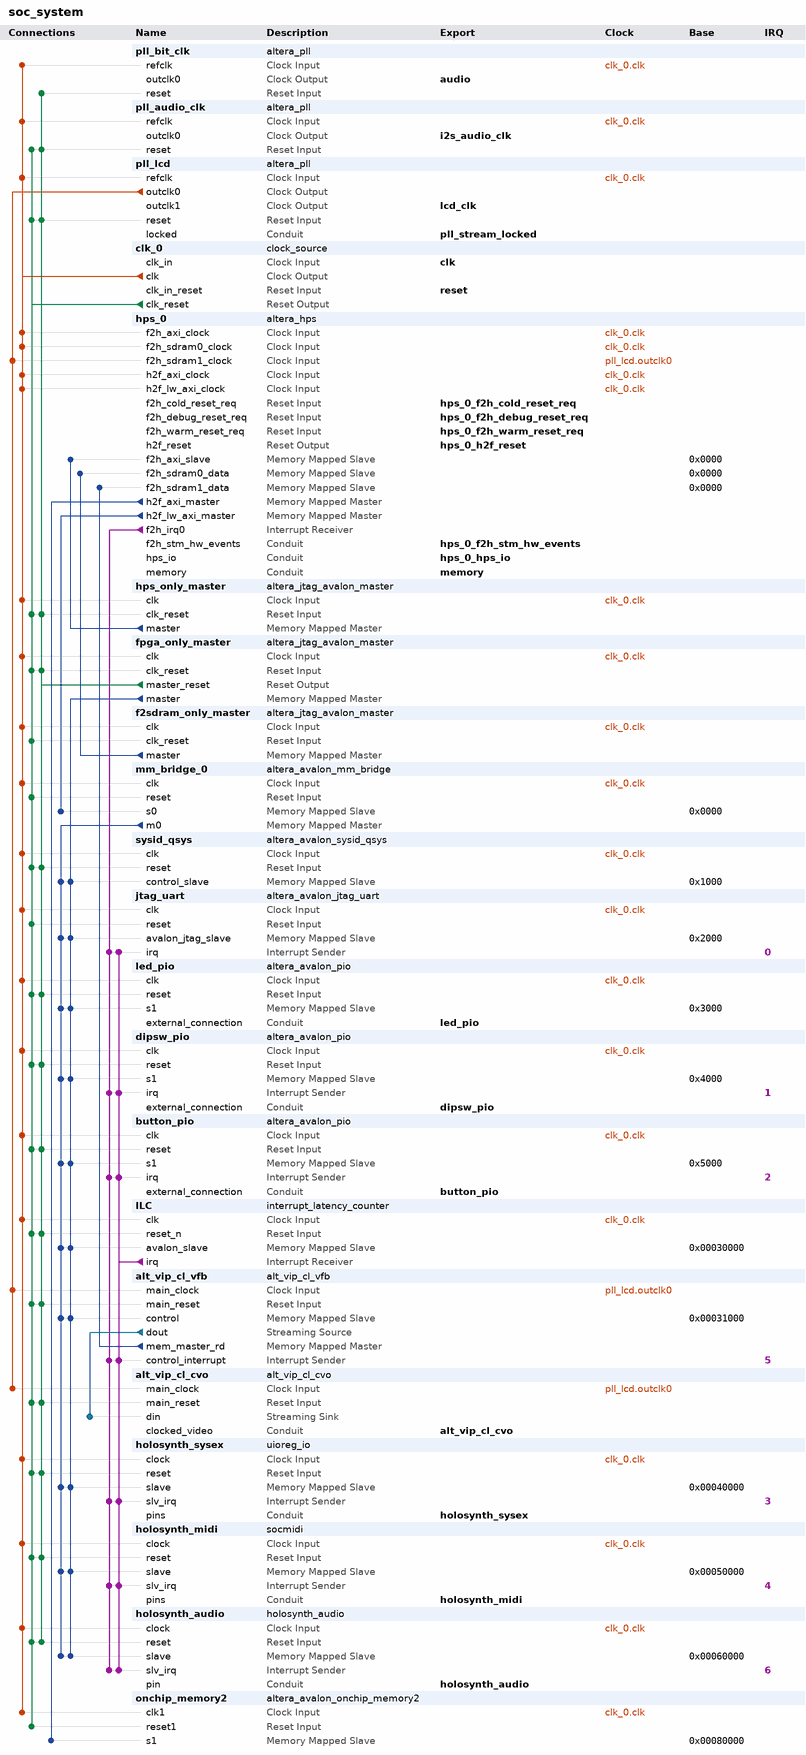
[diagram p0: system contents]
# Platform Designer (Qsys) system soc_system, Cyclone V 5CSEBA6U23I7
# Parameters at their usual value, and those the tool derives, are not listed.
package require -exact qsys 17.1
create_system soc_system
set_project_property DEVICE_FAMILY {Cyclone V}
set_project_property DEVICE 5CSEBA6U23I7

add_instance pll_bit_clk altera_pll 17.1
set_instance_parameter_value pll_bit_clk gui_device_speed_grade 2
set_instance_parameter_value pll_bit_clk gui_number_of_clocks 1
set_instance_parameter_value pll_bit_clk gui_operation_mode direct
set_instance_parameter_value pll_bit_clk gui_output_clock_frequency0 100.0
set_instance_parameter_value pll_bit_clk gui_pll_mode {Integer-N PLL}
set_instance_parameter_value pll_bit_clk gui_reference_clock_frequency 50.0
set_instance_parameter_value pll_bit_clk gui_use_locked false

add_instance pll_audio_clk altera_pll 17.1
set_instance_parameter_value pll_audio_clk gui_device_speed_grade 2
set_instance_parameter_value pll_audio_clk gui_number_of_clocks 1
set_instance_parameter_value pll_audio_clk gui_operation_mode direct
set_instance_parameter_value pll_audio_clk gui_output_clock_frequency0 33.8688
set_instance_parameter_value pll_audio_clk gui_pll_mode {Fractional-N PLL}
set_instance_parameter_value pll_audio_clk gui_reference_clock_frequency 50.0
set_instance_parameter_value pll_audio_clk gui_use_locked false

add_instance pll_lcd altera_pll 17.1
set_instance_parameter_value pll_lcd gui_device_speed_grade 2
set_instance_parameter_value pll_lcd gui_number_of_clocks 2
set_instance_parameter_value pll_lcd gui_operation_mode normal
set_instance_parameter_value pll_lcd gui_output_clock_frequency0 148.5
set_instance_parameter_value pll_lcd gui_output_clock_frequency1 148.5
set_instance_parameter_value pll_lcd gui_pll_mode {Fractional-N PLL}
set_instance_parameter_value pll_lcd gui_reference_clock_frequency 50.0
set_instance_parameter_value pll_lcd gui_use_locked true

add_instance clk_0 clock_source 17.1
set_instance_parameter_value clk_0 clockFrequency 50000000

add_instance hps_0 altera_hps 17.1
set_instance_parameter_value hps_0 EMAC1_Mode RGMII
set_instance_parameter_value hps_0 EMAC1_PinMuxing {HPS I/O Set 0}
set_instance_parameter_value hps_0 F2SCLK_COLDRST_Enable true
set_instance_parameter_value hps_0 F2SCLK_DBGRST_Enable true
set_instance_parameter_value hps_0 F2SCLK_WARMRST_Enable true
set_instance_parameter_value hps_0 F2SDRAM_Type {Avalon-MM Bidirectional,Avalon-MM Read-Only}
set_instance_parameter_value hps_0 F2SDRAM_Width 128,128
set_instance_parameter_value hps_0 F2SINTERRUPT_Enable true
set_instance_parameter_value hps_0 F2S_Width 2
set_instance_parameter_value hps_0 FPGA_PERIPHERAL_OUTPUT_CLOCK_FREQ_EMAC0_GTX_CLK 100
set_instance_parameter_value hps_0 FPGA_PERIPHERAL_OUTPUT_CLOCK_FREQ_EMAC0_MD_CLK 100.0
set_instance_parameter_value hps_0 FPGA_PERIPHERAL_OUTPUT_CLOCK_FREQ_EMAC1_GTX_CLK 100
set_instance_parameter_value hps_0 FPGA_PERIPHERAL_OUTPUT_CLOCK_FREQ_EMAC1_MD_CLK 100.0
set_instance_parameter_value hps_0 HPS_PROTOCOL DDR3
set_instance_parameter_value hps_0 I2C0_Mode I2C
set_instance_parameter_value hps_0 I2C0_PinMuxing {HPS I/O Set 0}
set_instance_parameter_value hps_0 I2C1_Mode I2C
set_instance_parameter_value hps_0 I2C1_PinMuxing {HPS I/O Set 0}
set_instance_parameter_value hps_0 LWH2F_Enable true
set_instance_parameter_value hps_0 MEM_BANKADDR_WIDTH 3
set_instance_parameter_value hps_0 MEM_CLK_FREQ 400.0
set_instance_parameter_value hps_0 MEM_COL_ADDR_WIDTH 10
set_instance_parameter_value hps_0 MEM_DQ_WIDTH 32
set_instance_parameter_value hps_0 MEM_DRV_STR RZQ/6
set_instance_parameter_value hps_0 MEM_ROW_ADDR_WIDTH 15
set_instance_parameter_value hps_0 MEM_RTT_NOM RZQ/6
set_instance_parameter_value hps_0 MEM_RTT_WR {Dynamic ODT off}
set_instance_parameter_value hps_0 MEM_TCL 7
set_instance_parameter_value hps_0 MEM_TFAW_NS 37.5
set_instance_parameter_value hps_0 MEM_TRAS_NS 35.0
set_instance_parameter_value hps_0 MEM_TRCD_NS 13.75
set_instance_parameter_value hps_0 MEM_TRFC_NS 300.0
set_instance_parameter_value hps_0 MEM_TRP_NS 13.75
set_instance_parameter_value hps_0 MEM_VENDOR Other
set_instance_parameter_value hps_0 MEM_WTCL 7
set_instance_parameter_value hps_0 QSPI_Mode N/A
set_instance_parameter_value hps_0 QSPI_PinMuxing Unused
set_instance_parameter_value hps_0 REF_CLK_FREQ 25.0
set_instance_parameter_value hps_0 S2FCLK_USER0CLK_Enable true
set_instance_parameter_value hps_0 S2FCLK_USER2CLK 4
set_instance_parameter_value hps_0 S2F_Width 2
set_instance_parameter_value hps_0 SDIO_Mode {4-bit Data}
set_instance_parameter_value hps_0 SDIO_PinMuxing {HPS I/O Set 0}
set_instance_parameter_value hps_0 SPIM1_Mode {Single Slave Select}
set_instance_parameter_value hps_0 SPIM1_PinMuxing {HPS I/O Set 0}
set_instance_parameter_value hps_0 STM_Enable true
set_instance_parameter_value hps_0 TIMING_BOARD_AC_SKEW 0.02
set_instance_parameter_value hps_0 TIMING_BOARD_AC_TO_CK_SKEW 0.0
set_instance_parameter_value hps_0 TIMING_BOARD_DQ_TO_DQS_SKEW 0.0
set_instance_parameter_value hps_0 TIMING_BOARD_MAX_CK_DELAY 0.6
set_instance_parameter_value hps_0 TIMING_BOARD_MAX_DQS_DELAY 0.6
set_instance_parameter_value hps_0 TIMING_BOARD_SKEW_BETWEEN_DQS 0.02
set_instance_parameter_value hps_0 TIMING_BOARD_SKEW_CKDQS_DIMM_MAX 0.01
set_instance_parameter_value hps_0 TIMING_BOARD_SKEW_CKDQS_DIMM_MIN -0.01
set_instance_parameter_value hps_0 TIMING_BOARD_SKEW_WITHIN_DQS 0.02
set_instance_parameter_value hps_0 TIMING_TDH 125
set_instance_parameter_value hps_0 TIMING_TDQSCK 400
set_instance_parameter_value hps_0 TIMING_TDQSQ 120
set_instance_parameter_value hps_0 TIMING_TDS 50
set_instance_parameter_value hps_0 TIMING_TIH 250
set_instance_parameter_value hps_0 TIMING_TIS 175
set_instance_parameter_value hps_0 TIMING_TQSH 0.38
set_instance_parameter_value hps_0 UART0_Mode {No Flow Control}
set_instance_parameter_value hps_0 UART0_PinMuxing {HPS I/O Set 0}
set_instance_parameter_value hps_0 USB1_Mode SDR
set_instance_parameter_value hps_0 USB1_PinMuxing {HPS I/O Set 0}
set_instance_parameter_value hps_0 desired_cfg_clk_mhz 100.0
set_instance_parameter_value hps_0 desired_qspi_clk_mhz 370.0

add_instance hps_only_master altera_jtag_avalon_master 17.1

add_instance fpga_only_master altera_jtag_avalon_master 17.1

add_instance f2sdram_only_master altera_jtag_avalon_master 17.1

add_instance mm_bridge_0 altera_avalon_mm_bridge 17.1
set_instance_parameter_value mm_bridge_0 ADDRESS_UNITS SYMBOLS
set_instance_parameter_value mm_bridge_0 ADDRESS_WIDTH 10
set_instance_parameter_value mm_bridge_0 DATA_WIDTH 32
set_instance_parameter_value mm_bridge_0 MAX_PENDING_RESPONSES 4
set_instance_parameter_value mm_bridge_0 USE_AUTO_ADDRESS_WIDTH 1

add_instance sysid_qsys altera_avalon_sysid_qsys 17.1
set_instance_parameter_value sysid_qsys id -1395322108

add_instance jtag_uart altera_avalon_jtag_uart 17.1
set_instance_parameter_value jtag_uart allowMultipleConnections true
set_instance_parameter_value jtag_uart simInteractiveOptions INTERACTIVE_ASCII_OUTPUT

add_instance led_pio altera_avalon_pio 17.1
set_instance_parameter_value led_pio direction Output
set_instance_parameter_value led_pio resetValue 255
set_instance_parameter_value led_pio width 8

add_instance dipsw_pio altera_avalon_pio 17.1
set_instance_parameter_value dipsw_pio bitClearingEdgeCapReg true
set_instance_parameter_value dipsw_pio captureEdge true
set_instance_parameter_value dipsw_pio direction Input
set_instance_parameter_value dipsw_pio edgeType ANY
set_instance_parameter_value dipsw_pio generateIRQ true
set_instance_parameter_value dipsw_pio irqType EDGE
set_instance_parameter_value dipsw_pio width 4

add_instance button_pio altera_avalon_pio 17.1
set_instance_parameter_value button_pio bitClearingEdgeCapReg true
set_instance_parameter_value button_pio captureEdge true
set_instance_parameter_value button_pio direction Input
set_instance_parameter_value button_pio edgeType FALLING
set_instance_parameter_value button_pio generateIRQ true
set_instance_parameter_value button_pio irqType EDGE
set_instance_parameter_value button_pio width 2

add_instance ILC interrupt_latency_counter 17.1
set_instance_parameter_value ILC IRQ_PORT_CNT 7

add_instance alt_vip_cl_vfb alt_vip_cl_vfb 17.1
set_instance_parameter_value alt_vip_cl_vfb CLOCKS_ARE_SEPARATE 0
set_instance_parameter_value alt_vip_cl_vfb DROP_FRAMES 1
set_instance_parameter_value alt_vip_cl_vfb DROP_INVALID_FIELDS 1
set_instance_parameter_value alt_vip_cl_vfb DROP_REPEAT_USER 0
set_instance_parameter_value alt_vip_cl_vfb IS_FRAME_READER 1
set_instance_parameter_value alt_vip_cl_vfb LINE_BASED_BUFFERING 0
set_instance_parameter_value alt_vip_cl_vfb MAX_HEIGHT 1080
set_instance_parameter_value alt_vip_cl_vfb MAX_WIDTH 1920
set_instance_parameter_value alt_vip_cl_vfb MEM_BASE_ADDR 536870912
set_instance_parameter_value alt_vip_cl_vfb MEM_BUFFER_OFFSET 16777216
set_instance_parameter_value alt_vip_cl_vfb MEM_PORT_WIDTH 128
set_instance_parameter_value alt_vip_cl_vfb NUMBER_OF_COLOR_PLANES 4
set_instance_parameter_value alt_vip_cl_vfb READER_RUNTIME_CONTROL 1
set_instance_parameter_value alt_vip_cl_vfb READ_BURST_TARGET 64
set_instance_parameter_value alt_vip_cl_vfb READ_FIFO_DEPTH 512
set_instance_parameter_value alt_vip_cl_vfb USER_PACKETS_MAX_STORAGE 0
set_instance_parameter_value alt_vip_cl_vfb USE_BUFFER_OFFSET 0
set_instance_parameter_value alt_vip_cl_vfb WRITE_BURST_TARGET 64
set_instance_parameter_value alt_vip_cl_vfb WRITE_FIFO_DEPTH 512

add_instance alt_vip_cl_cvo alt_vip_cl_cvo 17.1
set_instance_parameter_value alt_vip_cl_cvo ACCEPT_COLOURS_IN_SEQ 0
set_instance_parameter_value alt_vip_cl_cvo ACCEPT_SYNC 0
set_instance_parameter_value alt_vip_cl_cvo ANC_LINE 0
set_instance_parameter_value alt_vip_cl_cvo AP_LINE 0
set_instance_parameter_value alt_vip_cl_cvo BPS 8
set_instance_parameter_value alt_vip_cl_cvo CLOCKS_ARE_SAME 1
set_instance_parameter_value alt_vip_cl_cvo COLOUR_PLANES_ARE_IN_PARALLEL 1
set_instance_parameter_value alt_vip_cl_cvo CONTEXT_WIDTH 8
set_instance_parameter_value alt_vip_cl_cvo COUNT_STEP_IS_PIP_VALUE 0
set_instance_parameter_value alt_vip_cl_cvo DST_WIDTH 8
set_instance_parameter_value alt_vip_cl_cvo FIELD0_ANC_LINE 0
set_instance_parameter_value alt_vip_cl_cvo FIELD0_V_BACK_PORCH 0
set_instance_parameter_value alt_vip_cl_cvo FIELD0_V_BLANK 0
set_instance_parameter_value alt_vip_cl_cvo FIELD0_V_FRONT_PORCH 0
set_instance_parameter_value alt_vip_cl_cvo FIELD0_V_RISING_EDGE 0
set_instance_parameter_value alt_vip_cl_cvo FIELD0_V_SYNC_LENGTH 0
set_instance_parameter_value alt_vip_cl_cvo FIFO_DEPTH 1920
set_instance_parameter_value alt_vip_cl_cvo F_FALLING_EDGE 0
set_instance_parameter_value alt_vip_cl_cvo F_RISING_EDGE 0
set_instance_parameter_value alt_vip_cl_cvo GENERATE_SYNC 0
set_instance_parameter_value alt_vip_cl_cvo H_ACTIVE_PIXELS 1920
set_instance_parameter_value alt_vip_cl_cvo H_BACK_PORCH 148
set_instance_parameter_value alt_vip_cl_cvo H_BLANK 0
set_instance_parameter_value alt_vip_cl_cvo H_FRONT_PORCH 88
set_instance_parameter_value alt_vip_cl_cvo H_SYNC_LENGTH 44
set_instance_parameter_value alt_vip_cl_cvo INTERLACED 0
set_instance_parameter_value alt_vip_cl_cvo LOW_LATENCY 0
set_instance_parameter_value alt_vip_cl_cvo NO_OF_CHANNELS 1
set_instance_parameter_value alt_vip_cl_cvo NO_OF_MODES 1
set_instance_parameter_value alt_vip_cl_cvo NUMBER_OF_COLOUR_PLANES 4
set_instance_parameter_value alt_vip_cl_cvo PIXELS_IN_PARALLEL 1
set_instance_parameter_value alt_vip_cl_cvo SRC_WIDTH 8
set_instance_parameter_value alt_vip_cl_cvo STD_WIDTH 1
set_instance_parameter_value alt_vip_cl_cvo TASK_WIDTH 8
set_instance_parameter_value alt_vip_cl_cvo THRESHOLD 1919
set_instance_parameter_value alt_vip_cl_cvo USE_CONTROL 0
set_instance_parameter_value alt_vip_cl_cvo USE_EMBEDDED_SYNCS 0
set_instance_parameter_value alt_vip_cl_cvo V_ACTIVE_LINES 1080
set_instance_parameter_value alt_vip_cl_cvo V_BACK_PORCH 36
set_instance_parameter_value alt_vip_cl_cvo V_BLANK 0
set_instance_parameter_value alt_vip_cl_cvo V_FRONT_PORCH 4
set_instance_parameter_value alt_vip_cl_cvo V_SYNC_LENGTH 5

add_instance holosynth_sysex uioreg_io 1.1
set_instance_parameter_value holosynth_sysex ADDRESS_WIDTH 10
set_instance_parameter_value holosynth_sysex DATA_WIDTH 32
set_instance_parameter_value holosynth_sysex IRQ_EN 0

add_instance holosynth_midi socmidi 1.0
set_instance_parameter_value holosynth_midi ADDRESS_WIDTH 3
set_instance_parameter_value holosynth_midi DATA_WIDTH 8
set_instance_parameter_value holosynth_midi IRQ_EN 0

add_instance holosynth_audio holosynth_audio 1.0
set_instance_parameter_value holosynth_audio ADDRESS_WIDTH 14
set_instance_parameter_value holosynth_audio AUD_BIT_DEPTH 24
set_instance_parameter_value holosynth_audio DATA_WIDTH 32
set_instance_parameter_value holosynth_audio FIFO_WIDTH 10
set_instance_parameter_value holosynth_audio IRQ_EN 0

add_instance onchip_memory2 altera_avalon_onchip_memory2 17.1
set_instance_parameter_value onchip_memory2 dataWidth 64
set_instance_parameter_value onchip_memory2 dualPort false
set_instance_parameter_value onchip_memory2 initMemContent true
set_instance_parameter_value onchip_memory2 initializationFileName onchip_mem.hex
set_instance_parameter_value onchip_memory2 memorySize 262144

# connections
add_connection clk_0.clk button_pio.clk clock
add_connection clk_0.clk dipsw_pio.clk clock
add_connection clk_0.clk f2sdram_only_master.clk clock
add_connection clk_0.clk fpga_only_master.clk clock
add_connection clk_0.clk holosynth_audio.clock clock
add_connection clk_0.clk holosynth_midi.clock clock
add_connection clk_0.clk holosynth_sysex.clock clock
add_connection clk_0.clk hps_0.f2h_axi_clock clock
add_connection clk_0.clk hps_0.f2h_sdram0_clock clock
add_connection clk_0.clk hps_0.h2f_axi_clock clock
add_connection clk_0.clk hps_0.h2f_lw_axi_clock clock
add_connection clk_0.clk hps_only_master.clk clock
add_connection clk_0.clk ILC.clk clock
add_connection clk_0.clk jtag_uart.clk clock
add_connection clk_0.clk led_pio.clk clock
add_connection clk_0.clk mm_bridge_0.clk clock
add_connection clk_0.clk onchip_memory2.clk1 clock
add_connection clk_0.clk pll_audio_clk.refclk clock
add_connection clk_0.clk pll_bit_clk.refclk clock
add_connection clk_0.clk pll_lcd.refclk clock
add_connection clk_0.clk sysid_qsys.clk clock
add_connection pll_lcd.outclk0 alt_vip_cl_cvo.main_clock clock
add_connection pll_lcd.outclk0 alt_vip_cl_vfb.main_clock clock
add_connection pll_lcd.outclk0 hps_0.f2h_sdram1_clock clock
add_connection clk_0.clk_reset alt_vip_cl_cvo.main_reset reset
add_connection clk_0.clk_reset alt_vip_cl_vfb.main_reset reset
add_connection clk_0.clk_reset button_pio.reset reset
add_connection clk_0.clk_reset dipsw_pio.reset reset
add_connection clk_0.clk_reset f2sdram_only_master.clk_reset reset
add_connection clk_0.clk_reset fpga_only_master.clk_reset reset
add_connection clk_0.clk_reset holosynth_audio.reset reset
add_connection clk_0.clk_reset holosynth_midi.reset reset
add_connection clk_0.clk_reset holosynth_sysex.reset reset
add_connection clk_0.clk_reset hps_only_master.clk_reset reset
add_connection clk_0.clk_reset ILC.reset_n reset
add_connection clk_0.clk_reset jtag_uart.reset reset
add_connection clk_0.clk_reset led_pio.reset reset
add_connection clk_0.clk_reset mm_bridge_0.reset reset
add_connection clk_0.clk_reset onchip_memory2.reset1 reset
add_connection clk_0.clk_reset pll_audio_clk.reset reset
add_connection clk_0.clk_reset pll_lcd.reset reset
add_connection clk_0.clk_reset sysid_qsys.reset reset
add_connection fpga_only_master.master_reset alt_vip_cl_cvo.main_reset reset
add_connection fpga_only_master.master_reset alt_vip_cl_vfb.main_reset reset
add_connection fpga_only_master.master_reset button_pio.reset reset
add_connection fpga_only_master.master_reset dipsw_pio.reset reset
add_connection fpga_only_master.master_reset fpga_only_master.clk_reset reset
add_connection fpga_only_master.master_reset holosynth_audio.reset reset
add_connection fpga_only_master.master_reset holosynth_midi.reset reset
add_connection fpga_only_master.master_reset holosynth_sysex.reset reset
add_connection fpga_only_master.master_reset hps_only_master.clk_reset reset
add_connection fpga_only_master.master_reset ILC.reset_n reset
add_connection fpga_only_master.master_reset led_pio.reset reset
add_connection fpga_only_master.master_reset pll_audio_clk.reset reset
add_connection fpga_only_master.master_reset pll_bit_clk.reset reset
add_connection fpga_only_master.master_reset pll_lcd.reset reset
add_connection fpga_only_master.master_reset sysid_qsys.reset reset
add_connection alt_vip_cl_vfb.mem_master_rd hps_0.f2h_sdram1_data avalon
set_connection_parameter_value alt_vip_cl_vfb.mem_master_rd/hps_0.f2h_sdram1_data baseAddress 0x0000
add_connection f2sdram_only_master.master hps_0.f2h_sdram0_data avalon
set_connection_parameter_value f2sdram_only_master.master/hps_0.f2h_sdram0_data baseAddress 0x0000
add_connection fpga_only_master.master alt_vip_cl_vfb.control avalon
set_connection_parameter_value fpga_only_master.master/alt_vip_cl_vfb.control baseAddress 0x00031000
add_connection fpga_only_master.master button_pio.s1 avalon
set_connection_parameter_value fpga_only_master.master/button_pio.s1 baseAddress 0x5000
add_connection fpga_only_master.master dipsw_pio.s1 avalon
set_connection_parameter_value fpga_only_master.master/dipsw_pio.s1 baseAddress 0x4000
add_connection fpga_only_master.master holosynth_audio.slave avalon
set_connection_parameter_value fpga_only_master.master/holosynth_audio.slave baseAddress 0x00060000
add_connection fpga_only_master.master holosynth_midi.slave avalon
set_connection_parameter_value fpga_only_master.master/holosynth_midi.slave baseAddress 0x00050000
add_connection fpga_only_master.master holosynth_sysex.slave avalon
set_connection_parameter_value fpga_only_master.master/holosynth_sysex.slave baseAddress 0x00040000
add_connection fpga_only_master.master ILC.avalon_slave avalon
set_connection_parameter_value fpga_only_master.master/ILC.avalon_slave baseAddress 0x00030000
add_connection fpga_only_master.master jtag_uart.avalon_jtag_slave avalon
set_connection_parameter_value fpga_only_master.master/jtag_uart.avalon_jtag_slave baseAddress 0x2000
add_connection fpga_only_master.master led_pio.s1 avalon
set_connection_parameter_value fpga_only_master.master/led_pio.s1 baseAddress 0x3000
add_connection fpga_only_master.master sysid_qsys.control_slave avalon
set_connection_parameter_value fpga_only_master.master/sysid_qsys.control_slave baseAddress 0x1000
add_connection hps_0.h2f_axi_master onchip_memory2.s1 avalon
set_connection_parameter_value hps_0.h2f_axi_master/onchip_memory2.s1 baseAddress 0x00080000
add_connection hps_0.h2f_lw_axi_master mm_bridge_0.s0 avalon
set_connection_parameter_value hps_0.h2f_lw_axi_master/mm_bridge_0.s0 baseAddress 0x0000
add_connection hps_only_master.master hps_0.f2h_axi_slave avalon
set_connection_parameter_value hps_only_master.master/hps_0.f2h_axi_slave baseAddress 0x0000
add_connection mm_bridge_0.m0 alt_vip_cl_vfb.control avalon
set_connection_parameter_value mm_bridge_0.m0/alt_vip_cl_vfb.control baseAddress 0x00031000
add_connection mm_bridge_0.m0 button_pio.s1 avalon
set_connection_parameter_value mm_bridge_0.m0/button_pio.s1 baseAddress 0x5000
add_connection mm_bridge_0.m0 dipsw_pio.s1 avalon
set_connection_parameter_value mm_bridge_0.m0/dipsw_pio.s1 baseAddress 0x4000
add_connection mm_bridge_0.m0 holosynth_audio.slave avalon
set_connection_parameter_value mm_bridge_0.m0/holosynth_audio.slave baseAddress 0x00060000
add_connection mm_bridge_0.m0 holosynth_midi.slave avalon
set_connection_parameter_value mm_bridge_0.m0/holosynth_midi.slave baseAddress 0x00050000
add_connection mm_bridge_0.m0 holosynth_sysex.slave avalon
set_connection_parameter_value mm_bridge_0.m0/holosynth_sysex.slave baseAddress 0x00040000
add_connection mm_bridge_0.m0 ILC.avalon_slave avalon
set_connection_parameter_value mm_bridge_0.m0/ILC.avalon_slave baseAddress 0x00030000
add_connection mm_bridge_0.m0 jtag_uart.avalon_jtag_slave avalon
set_connection_parameter_value mm_bridge_0.m0/jtag_uart.avalon_jtag_slave baseAddress 0x2000
add_connection mm_bridge_0.m0 led_pio.s1 avalon
set_connection_parameter_value mm_bridge_0.m0/led_pio.s1 baseAddress 0x3000
add_connection mm_bridge_0.m0 sysid_qsys.control_slave avalon
set_connection_parameter_value mm_bridge_0.m0/sysid_qsys.control_slave baseAddress 0x1000
add_connection alt_vip_cl_vfb.dout alt_vip_cl_cvo.din avalon_streaming
add_connection hps_0.f2h_irq0 alt_vip_cl_vfb.control_interrupt interrupt
set_connection_parameter_value hps_0.f2h_irq0/alt_vip_cl_vfb.control_interrupt irqNumber 5
add_connection hps_0.f2h_irq0 button_pio.irq interrupt
set_connection_parameter_value hps_0.f2h_irq0/button_pio.irq irqNumber 2
add_connection hps_0.f2h_irq0 dipsw_pio.irq interrupt
set_connection_parameter_value hps_0.f2h_irq0/dipsw_pio.irq irqNumber 1
add_connection hps_0.f2h_irq0 holosynth_audio.slv_irq interrupt
set_connection_parameter_value hps_0.f2h_irq0/holosynth_audio.slv_irq irqNumber 6
add_connection hps_0.f2h_irq0 holosynth_midi.slv_irq interrupt
set_connection_parameter_value hps_0.f2h_irq0/holosynth_midi.slv_irq irqNumber 4
add_connection hps_0.f2h_irq0 holosynth_sysex.slv_irq interrupt
set_connection_parameter_value hps_0.f2h_irq0/holosynth_sysex.slv_irq irqNumber 3
add_connection hps_0.f2h_irq0 jtag_uart.irq interrupt
set_connection_parameter_value hps_0.f2h_irq0/jtag_uart.irq irqNumber 0
add_connection ILC.irq alt_vip_cl_vfb.control_interrupt interrupt
set_connection_parameter_value ILC.irq/alt_vip_cl_vfb.control_interrupt irqNumber 5
add_connection ILC.irq button_pio.irq interrupt
set_connection_parameter_value ILC.irq/button_pio.irq irqNumber 2
add_connection ILC.irq dipsw_pio.irq interrupt
set_connection_parameter_value ILC.irq/dipsw_pio.irq irqNumber 1
add_connection ILC.irq holosynth_audio.slv_irq interrupt
set_connection_parameter_value ILC.irq/holosynth_audio.slv_irq irqNumber 6
add_connection ILC.irq holosynth_midi.slv_irq interrupt
set_connection_parameter_value ILC.irq/holosynth_midi.slv_irq irqNumber 4
add_connection ILC.irq holosynth_sysex.slv_irq interrupt
set_connection_parameter_value ILC.irq/holosynth_sysex.slv_irq irqNumber 3
add_connection ILC.irq jtag_uart.irq interrupt
set_connection_parameter_value ILC.irq/jtag_uart.irq irqNumber 0

# exported interfaces
add_interface alt_vip_cl_cvo conduit end
set_interface_property alt_vip_cl_cvo EXPORT_OF alt_vip_cl_cvo.clocked_video
add_interface audio clock source
set_interface_property audio EXPORT_OF pll_bit_clk.outclk0
add_interface button_pio conduit end
set_interface_property button_pio EXPORT_OF button_pio.external_connection
add_interface clk clock sink
set_interface_property clk EXPORT_OF clk_0.clk_in
add_interface dipsw_pio conduit end
set_interface_property dipsw_pio EXPORT_OF dipsw_pio.external_connection
add_interface holosynth_audio conduit end
set_interface_property holosynth_audio EXPORT_OF holosynth_audio.pin
add_interface holosynth_midi conduit end
set_interface_property holosynth_midi EXPORT_OF holosynth_midi.pins
add_interface holosynth_sysex conduit end
set_interface_property holosynth_sysex EXPORT_OF holosynth_sysex.pins
add_interface hps_0_f2h_cold_reset_req reset sink
set_interface_property hps_0_f2h_cold_reset_req EXPORT_OF hps_0.f2h_cold_reset_req
add_interface hps_0_f2h_debug_reset_req reset sink
set_interface_property hps_0_f2h_debug_reset_req EXPORT_OF hps_0.f2h_debug_reset_req
add_interface hps_0_f2h_stm_hw_events conduit end
set_interface_property hps_0_f2h_stm_hw_events EXPORT_OF hps_0.f2h_stm_hw_events
add_interface hps_0_f2h_warm_reset_req reset sink
set_interface_property hps_0_f2h_warm_reset_req EXPORT_OF hps_0.f2h_warm_reset_req
add_interface hps_0_h2f_reset reset source
set_interface_property hps_0_h2f_reset EXPORT_OF hps_0.h2f_reset
add_interface hps_0_hps_io conduit end
set_interface_property hps_0_hps_io EXPORT_OF hps_0.hps_io
add_interface i2s_audio_clk clock source
set_interface_property i2s_audio_clk EXPORT_OF pll_audio_clk.outclk0
add_interface lcd_clk clock source
set_interface_property lcd_clk EXPORT_OF pll_lcd.outclk1
add_interface led_pio conduit end
set_interface_property led_pio EXPORT_OF led_pio.external_connection
add_interface memory conduit end
set_interface_property memory EXPORT_OF hps_0.memory
add_interface pll_stream_locked conduit end
set_interface_property pll_stream_locked EXPORT_OF pll_lcd.locked
add_interface reset reset sink
set_interface_property reset EXPORT_OF clk_0.clk_in_reset

set_interconnect_requirement {$system} qsys_mm.clockCrossingAdapter AUTO
set_interconnect_requirement {$system} qsys_mm.maxAdditionalLatency 2
set_interconnect_requirement hps_only_master.master qsys_mm.security SECURE

save_system soc_system.qsys
